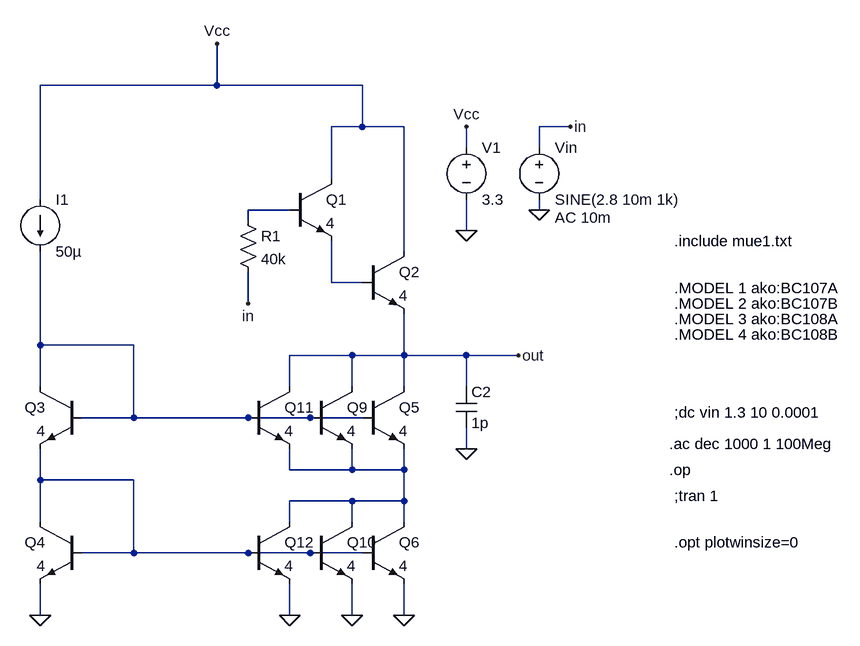
[diagram p0: schematic final_q2 - Copy.asc]
final_q2 - Copy.asc, the LTspice schematic file:
Version 4
SHEET 1 2364 1012
WIRE 176 0 176 -64
WIRE 176 0 -96 0
WIRE 400 0 176 0
WIRE 400 64 400 0
WIRE 400 64 352 64
WIRE 464 64 400 64
WIRE 720 64 672 64
WIRE 560 96 560 64
WIRE 672 96 672 64
WIRE 352 144 352 64
WIRE -96 176 -96 0
WIRE 288 192 224 192
WIRE 672 192 672 176
WIRE 224 208 224 192
WIRE 560 224 560 176
WIRE 464 256 464 64
WIRE 352 304 352 240
WIRE 400 304 352 304
WIRE 224 336 224 288
WIRE -96 400 -96 256
WIRE 48 400 -96 400
WIRE 384 416 288 416
WIRE 464 416 464 352
WIRE 464 416 384 416
WIRE 560 416 464 416
WIRE 640 416 560 416
WIRE -96 464 -96 400
WIRE 288 464 288 416
WIRE 384 464 384 416
WIRE 464 464 464 416
WIRE 560 464 560 416
WIRE 48 512 48 400
WIRE 48 512 -32 512
WIRE 224 512 48 512
WIRE 320 512 224 512
WIRE 400 512 320 512
WIRE 560 560 560 528
WIRE 288 592 288 560
WIRE 384 592 384 560
WIRE 384 592 288 592
WIRE 464 592 464 560
WIRE 464 592 384 592
WIRE -96 608 -96 560
WIRE 48 608 -96 608
WIRE 384 640 288 640
WIRE 464 640 464 592
WIRE 464 640 384 640
WIRE -96 672 -96 608
WIRE 288 672 288 640
WIRE 384 672 384 640
WIRE 464 672 464 640
WIRE 48 720 48 608
WIRE 48 720 -32 720
WIRE 224 720 48 720
WIRE 320 720 224 720
WIRE 400 720 320 720
WIRE -96 816 -96 768
WIRE 288 816 288 768
WIRE 384 816 384 768
WIRE 464 816 464 768
FLAG 672 192 0
FLAG 720 64 in
FLAG 560 224 0
FLAG 560 64 Vcc
FLAG 176 -64 Vcc
FLAG -96 816 0
FLAG 464 816 0
FLAG 640 416 out
FLAG 560 560 0
FLAG 384 816 0
FLAG 288 816 0
FLAG 224 336 in
SYMBOL npn 288 144 R0
SYMATTR InstName Q1
SYMATTR Value 4
SYMBOL npn 400 256 R0
SYMATTR InstName Q2
SYMATTR Value 4
SYMBOL npn -32 464 M0
SYMATTR InstName Q3
SYMATTR Value 4
SYMBOL current -96 176 R0
WINDOW 123 0 0 Left 0
WINDOW 39 0 0 Left 0
SYMATTR InstName I1
SYMATTR Value 50µ
SYMBOL voltage 672 80 R0
WINDOW 123 24 124 Left 2
WINDOW 39 0 0 Left 0
SYMATTR Value2 AC 10m
SYMATTR InstName Vin
SYMATTR Value SINE(2.8 10m 1k)
SYMBOL voltage 560 80 R0
WINDOW 123 0 0 Left 0
WINDOW 39 0 0 Left 0
SYMATTR InstName V1
SYMATTR Value 3.3
SYMBOL npn -32 672 M0
SYMATTR InstName Q4
SYMATTR Value 4
SYMBOL npn 400 464 R0
SYMATTR InstName Q5
SYMATTR Value 4
SYMBOL npn 400 672 R0
SYMATTR InstName Q6
SYMATTR Value 4
SYMBOL cap 544 464 R0
SYMATTR InstName C2
SYMATTR Value 1p
SYMBOL npn 320 464 R0
SYMATTR InstName Q9
SYMATTR Value 4
SYMBOL npn 320 672 R0
SYMATTR InstName Q10
SYMATTR Value 4
SYMBOL npn 224 464 R0
SYMATTR InstName Q11
SYMATTR Value 4
SYMBOL npn 224 672 R0
SYMATTR InstName Q12
SYMATTR Value 4
SYMBOL res 208 192 R0
SYMATTR InstName R1
SYMATTR Value 40k
TEXT 880 240 Left 2 !.include mue1.txt
TEXT 880 504 Left 2 !;dc vin 1.3 10 0.0001
TEXT 872 552 Left 2 !.ac dec 1000 1 100Meg
TEXT 880 312 Left 2 !.MODEL 1 ako:BC107A
TEXT 880 336 Left 2 !.MODEL 2 ako:BC107B
TEXT 880 360 Left 2 !.MODEL 3 ako:BC108A
TEXT 872 592 Left 2 !.op
TEXT 880 384 Left 2 !.MODEL 4 ako:BC108B
TEXT 880 632 Left 2 !;tran 1
TEXT 880 704 Left 2 !.opt plotwinsize=0

The netlist it stands for:
* final_q2 - Copy.asc
Q1 Vcc N001 N002 0 4
Q2 Vcc N002 out 0 4
Q3 N003 N003 N005 0 4
I1 Vcc N003 50µ
Vin in 0 SINE(2.8 10m 1k) AC 10m
V1 Vcc 0 3.3
Q4 N005 N005 0 0 4
Q5 out N003 N004 0 4
Q6 N004 N005 0 0 4
C2 out 0 1p
Q9 out N003 N004 0 4
Q10 N004 N005 0 0 4
Q11 out N003 N004 0 4
Q12 N004 N005 0 0 4
R1 N001 in 40k
.model NPN NPN
.model PNP PNP
.lib standard.bjt
.include mue1.txt
;dc vin 1.3 10 0.0001
.ac dec 1000 1 100Meg
.MODEL 1 ako:BC107A
.MODEL 2 ako:BC107B
.MODEL 3 ako:BC108A
.op
.MODEL 4 ako:BC108B
;tran 1
.opt plotwinsize=0
.backanno
.end